# Altium schematic sheet encoder.SchDoc
size A4; SheetNumber: 6; SheetTotal: 7
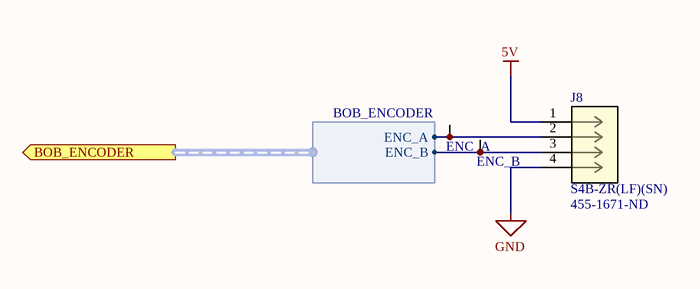
[diagram p0: encoder.SchDoc]

## Parts
ENC_A  Test Point (Via)  [TP]  (value not drawn)
ENC_B  Test Point (Via)  [TP]  (value not drawn)
J8  S4B-ZR(LF)(SN)  Supplier Part Number 1: 455-1671-ND  [CN S4B-ZR(LF)(SN)_JST]

## Ports
BOB_ENCODER (out, harness BOB_ENCODER)

## Harnesses
BOB_ENCODER: ENC_A, ENC_B

## Nets
5V: J8.1
GND: J8.4
NetENC_A_1: ENC_A.1 J8.2 ; port BOB_ENCODER.ENC_A
NetENC_B_1: ENC_B.1 J8.3 ; port BOB_ENCODER.ENC_B

## Library data of the parts
J8 = CN HDR 4POS JST ZR: Connector Header Through Hole, Right Angle 4 position 0.059" (1.50mm); Mfr_Name: JST; Copyright: Copyright (C) 2021 Ultra Librarian. All rights reserved.; Manufacturer_Part_Number: S4B-ZR(LF)(SN); Digi-Key_Part_Number_1: 455-1671-ND; RefDes: RefDes; Type: DEV; Supplier 1: Digi-Key